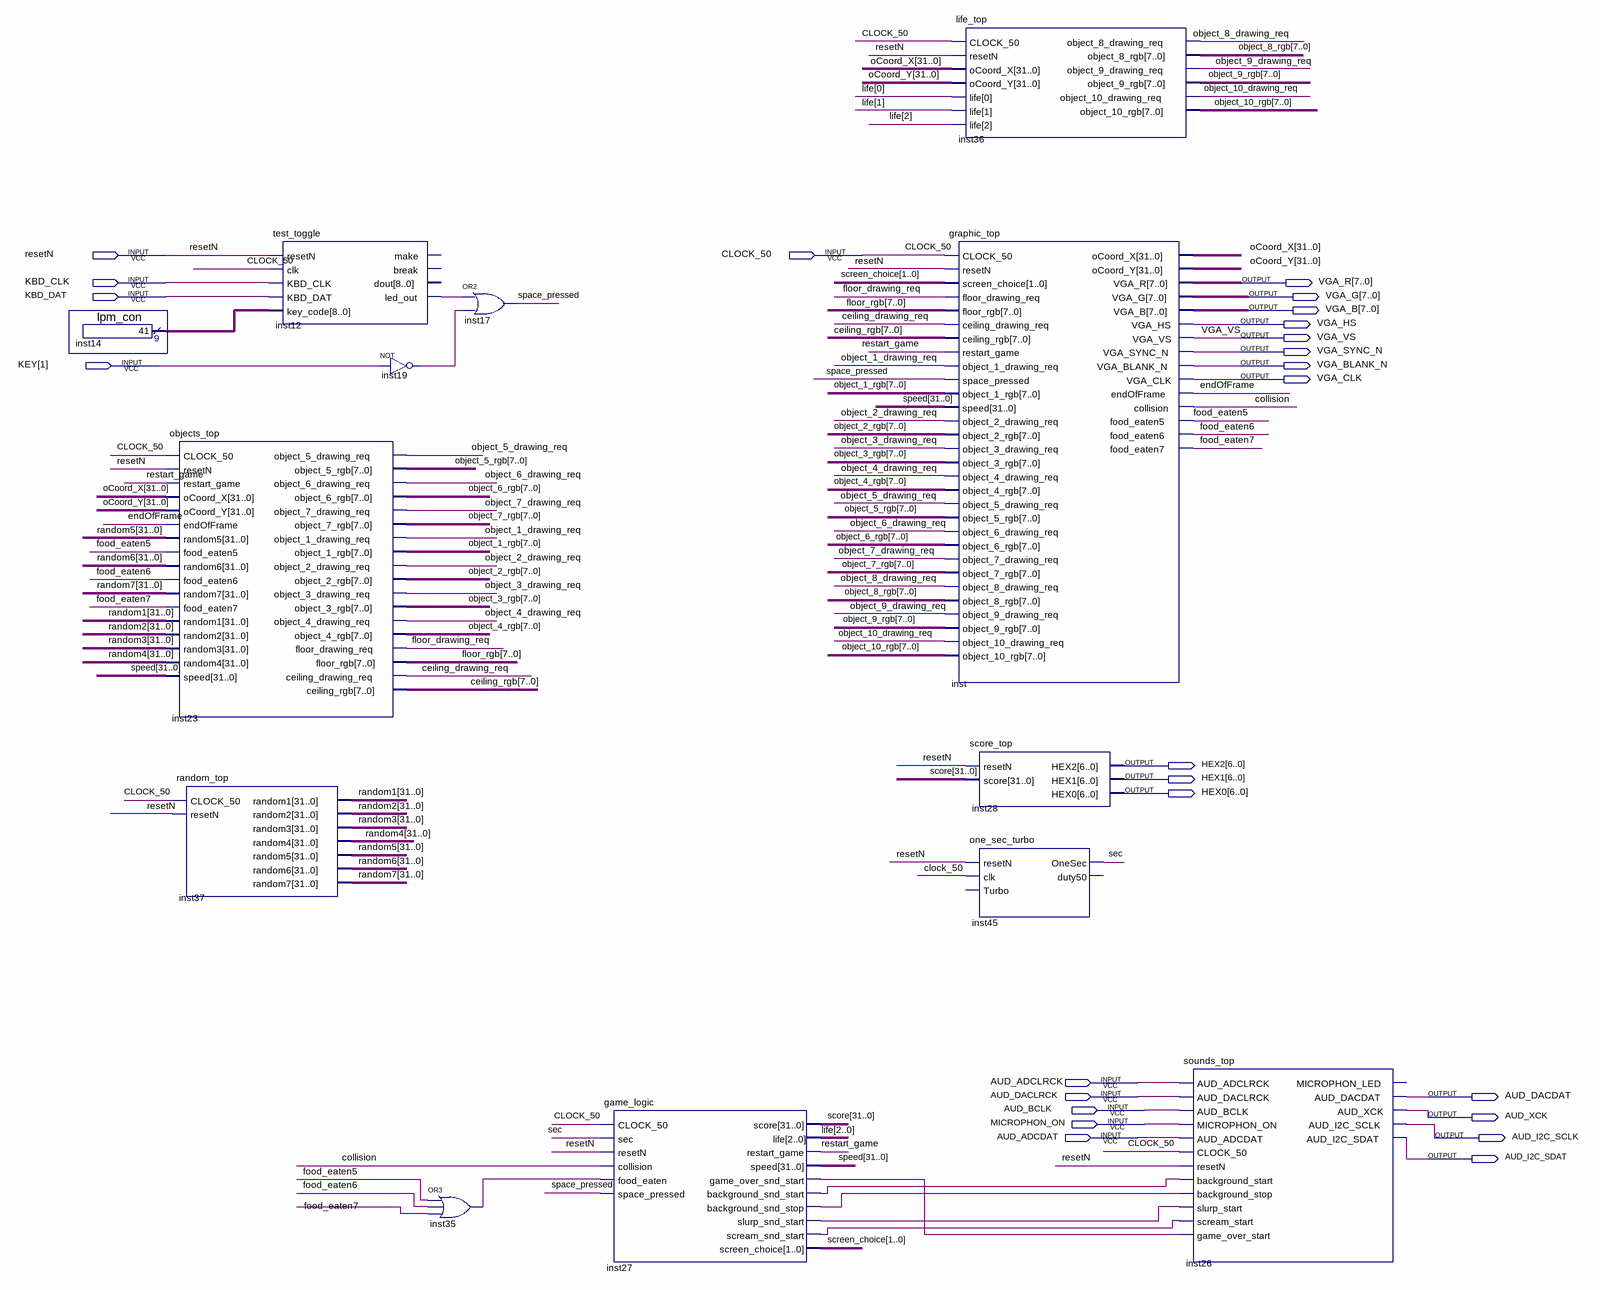
[diagram p0: schematic sheet]
// Quartus schematic TOP_SIFTACH.bdf as structural Verilog: 13 symbols, 25 pins
module TOP_SIFTACH (
  input  resetN,
  input  CLOCK_50,
  input  KBD_CLK,
  input  KBD_DAT,
  input  [1:1] KEY,
  input  AUD_ADCLRCK,
  input  AUD_DACLRCK,
  input  AUD_BCLK,
  input  MICROPHON_ON,
  input  AUD_ADCDAT,
  output [7:0] VGA_R,
  output [7:0] VGA_G,
  output [7:0] VGA_B,
  output VGA_HS,
  output VGA_VS,
  output VGA_SYNC_N,
  output VGA_BLANK_N,
  output VGA_CLK,
  output [6:0] HEX2,
  output [6:0] HEX1,
  output [6:0] HEX0,
  output AUD_DACDAT,
  output AUD_XCK,
  output AUD_I2C_SCLK,
  output AUD_I2C_SDAT
);

  wire ceiling_drawing_req, collision, endOfFrame, floor_drawing_req, food_eaten5, food_eaten6, food_eaten7,
       inst12_led_out, inst19_out, inst27_background_snd_start, inst27_background_snd_stop,
       inst27_game_over_snd_start, inst27_scream_snd_start, inst27_slurp_snd_start, inst35_out,
       object_1_drawing_req, object_2_drawing_req, object_3_drawing_req, object_4_drawing_req,
       object_5_drawing_req, object_6_drawing_req, object_7_drawing_req, object_8_drawing_req,
       object_9_drawing_req, object_10_drawing_req, restart_game, sec, space_pressed;
  wire [1:0] screen_choice;
  wire [2:0] life;
  wire [7:0] ceiling_rgb, floor_rgb, object_1_rgb, object_2_rgb, object_3_rgb, object_4_rgb, object_5_rgb,
       object_6_rgb, object_7_rgb, object_8_rgb, object_9_rgb, object_10_rgb;
  wire [8:0] inst14_result;
  wire [31:0] oCoord_X, oCoord_Y, random1, random2, random3, random4, random5, random6, random7, score, speed;

  lpm_con inst14 (.result(inst14_result));
  objects_top inst23 (
    .CLOCK_50(CLOCK_50), .resetN(resetN), .restart_game(restart_game), .oCoord_X(oCoord_X),
    .oCoord_Y(oCoord_Y), .endOfFrame(endOfFrame), .random5(random5), .food_eaten5(food_eaten5),
    .random6(random6), .food_eaten6(food_eaten6), .random7(random7), .food_eaten7(food_eaten7),
    .random1(random1), .random2(random2), .random3(random3), .random4(random4), .speed(speed),
    .object_5_drawing_req(object_5_drawing_req), .object_5_rgb(object_5_rgb),
    .object_6_drawing_req(object_6_drawing_req), .object_6_rgb(object_6_rgb),
    .object_7_drawing_req(object_7_drawing_req), .object_7_rgb(object_7_rgb),
    .object_1_drawing_req(object_1_drawing_req), .object_1_rgb(object_1_rgb),
    .object_2_drawing_req(object_2_drawing_req), .object_2_rgb(object_2_rgb),
    .object_3_drawing_req(object_3_drawing_req), .object_3_rgb(object_3_rgb),
    .object_4_drawing_req(object_4_drawing_req), .object_4_rgb(object_4_rgb),
    .floor_drawing_req(floor_drawing_req), .floor_rgb(floor_rgb), .ceiling_drawing_req(ceiling_drawing_req),
    .ceiling_rgb(ceiling_rgb));
  random_top inst37 (
    .CLOCK_50(CLOCK_50), .resetN(resetN), .random1(random1), .random2(random2), .random3(random3),
    .random4(random4), .random5(random5), .random6(random6), .random7(random7));
  test_toggle inst12 (
    .resetN(resetN), .clk(CLOCK_50), .KBD_CLK(KBD_CLK), .KBD_DAT(KBD_DAT), .key_code(inst14_result),
    .led_out(inst12_led_out));  // open: make, break, dout
  not inst19 (inst19_out, KEY[1]);
  or inst35 (inst35_out, food_eaten5, food_eaten6, food_eaten7);
  or inst17 (space_pressed, inst12_led_out, inst19_out);
  game_logic inst27 (
    .CLOCK_50(CLOCK_50), .sec(sec), .resetN(resetN), .collision(collision), .food_eaten(inst35_out),
    .space_pressed(space_pressed), .score(score), .life(life), .restart_game(restart_game), .speed(speed),
    .game_over_snd_start(inst27_game_over_snd_start), .background_snd_start(inst27_background_snd_start),
    .background_snd_stop(inst27_background_snd_stop), .slurp_snd_start(inst27_slurp_snd_start),
    .scream_snd_start(inst27_scream_snd_start), .screen_choice(screen_choice));
  life_top inst36 (
    .CLOCK_50(CLOCK_50), .resetN(resetN), .oCoord_X(oCoord_X), .oCoord_Y(oCoord_Y), .life(life),
    .object_8_drawing_req(object_8_drawing_req), .object_8_rgb(object_8_rgb),
    .object_9_drawing_req(object_9_drawing_req), .object_9_rgb(object_9_rgb),
    .object_10_drawing_req(object_10_drawing_req), .object_10_rgb(object_10_rgb));
  graphic_top inst (
    .CLOCK_50(CLOCK_50), .resetN(resetN), .screen_choice(screen_choice),
    .floor_drawing_req(floor_drawing_req), .floor_rgb(floor_rgb), .ceiling_drawing_req(ceiling_drawing_req),
    .ceiling_rgb(ceiling_rgb), .restart_game(restart_game), .object_1_drawing_req(object_1_drawing_req),
    .space_pressed(space_pressed), .object_1_rgb(object_1_rgb), .speed(speed),
    .object_2_drawing_req(object_2_drawing_req), .object_2_rgb(object_2_rgb),
    .object_3_drawing_req(object_3_drawing_req), .object_3_rgb(object_3_rgb),
    .object_4_drawing_req(object_4_drawing_req), .object_4_rgb(object_4_rgb),
    .object_5_drawing_req(object_5_drawing_req), .object_5_rgb(object_5_rgb),
    .object_6_drawing_req(object_6_drawing_req), .object_6_rgb(object_6_rgb),
    .object_7_drawing_req(object_7_drawing_req), .object_7_rgb(object_7_rgb),
    .object_8_drawing_req(object_8_drawing_req), .object_8_rgb(object_8_rgb),
    .object_9_drawing_req(object_9_drawing_req), .object_9_rgb(object_9_rgb),
    .object_10_drawing_req(object_10_drawing_req), .object_10_rgb(object_10_rgb), .oCoord_X(oCoord_X),
    .oCoord_Y(oCoord_Y), .VGA_R(VGA_R), .VGA_G(VGA_G), .VGA_B(VGA_B), .VGA_HS(VGA_HS), .VGA_VS(VGA_VS),
    .VGA_SYNC_N(VGA_SYNC_N), .VGA_BLANK_N(VGA_BLANK_N), .VGA_CLK(VGA_CLK), .endOfFrame(endOfFrame),
    .collision(collision), .food_eaten5(food_eaten5), .food_eaten6(food_eaten6), .food_eaten7(food_eaten7));
  score_top inst28 (.resetN(resetN), .score(score), .HEX2(HEX2), .HEX1(HEX1), .HEX0(HEX0));
  one_sec_turbo inst45 (.resetN(resetN), .clk(CLOCK_50), .OneSec(sec));  // open: Turbo, duty50
  sounds_top inst26 (
    .AUD_ADCLRCK(AUD_ADCLRCK), .AUD_DACLRCK(AUD_DACLRCK), .AUD_BCLK(AUD_BCLK), .MICROPHON_ON(MICROPHON_ON),
    .AUD_ADCDAT(AUD_ADCDAT), .CLOCK_50(CLOCK_50), .resetN(resetN),
    .background_start(inst27_background_snd_start), .background_stop(inst27_background_snd_stop),
    .slurp_start(inst27_slurp_snd_start), .scream_start(inst27_scream_snd_start),
    .game_over_start(inst27_game_over_snd_start), .AUD_DACDAT(AUD_DACDAT), .AUD_XCK(AUD_XCK),
    .AUD_I2C_SCLK(AUD_I2C_SCLK), .AUD_I2C_SDAT(AUD_I2C_SDAT));  // open: MICROPHON_LED
endmodule
